# Altium schematic sheet 05 - SAMA7D65-MPU.SchDoc
size B; CompanyName: Microchip Technology Inc.; Organization: Microchip Technology; Address1: 2355 West Chandler Blvd.; Address2: Chandler, AZ  85224; Address4: USA; DocumentNumber: 5; SheetNumber: 5; SheetTotal: 15; SheetTitle: SAMA7D65 SoC
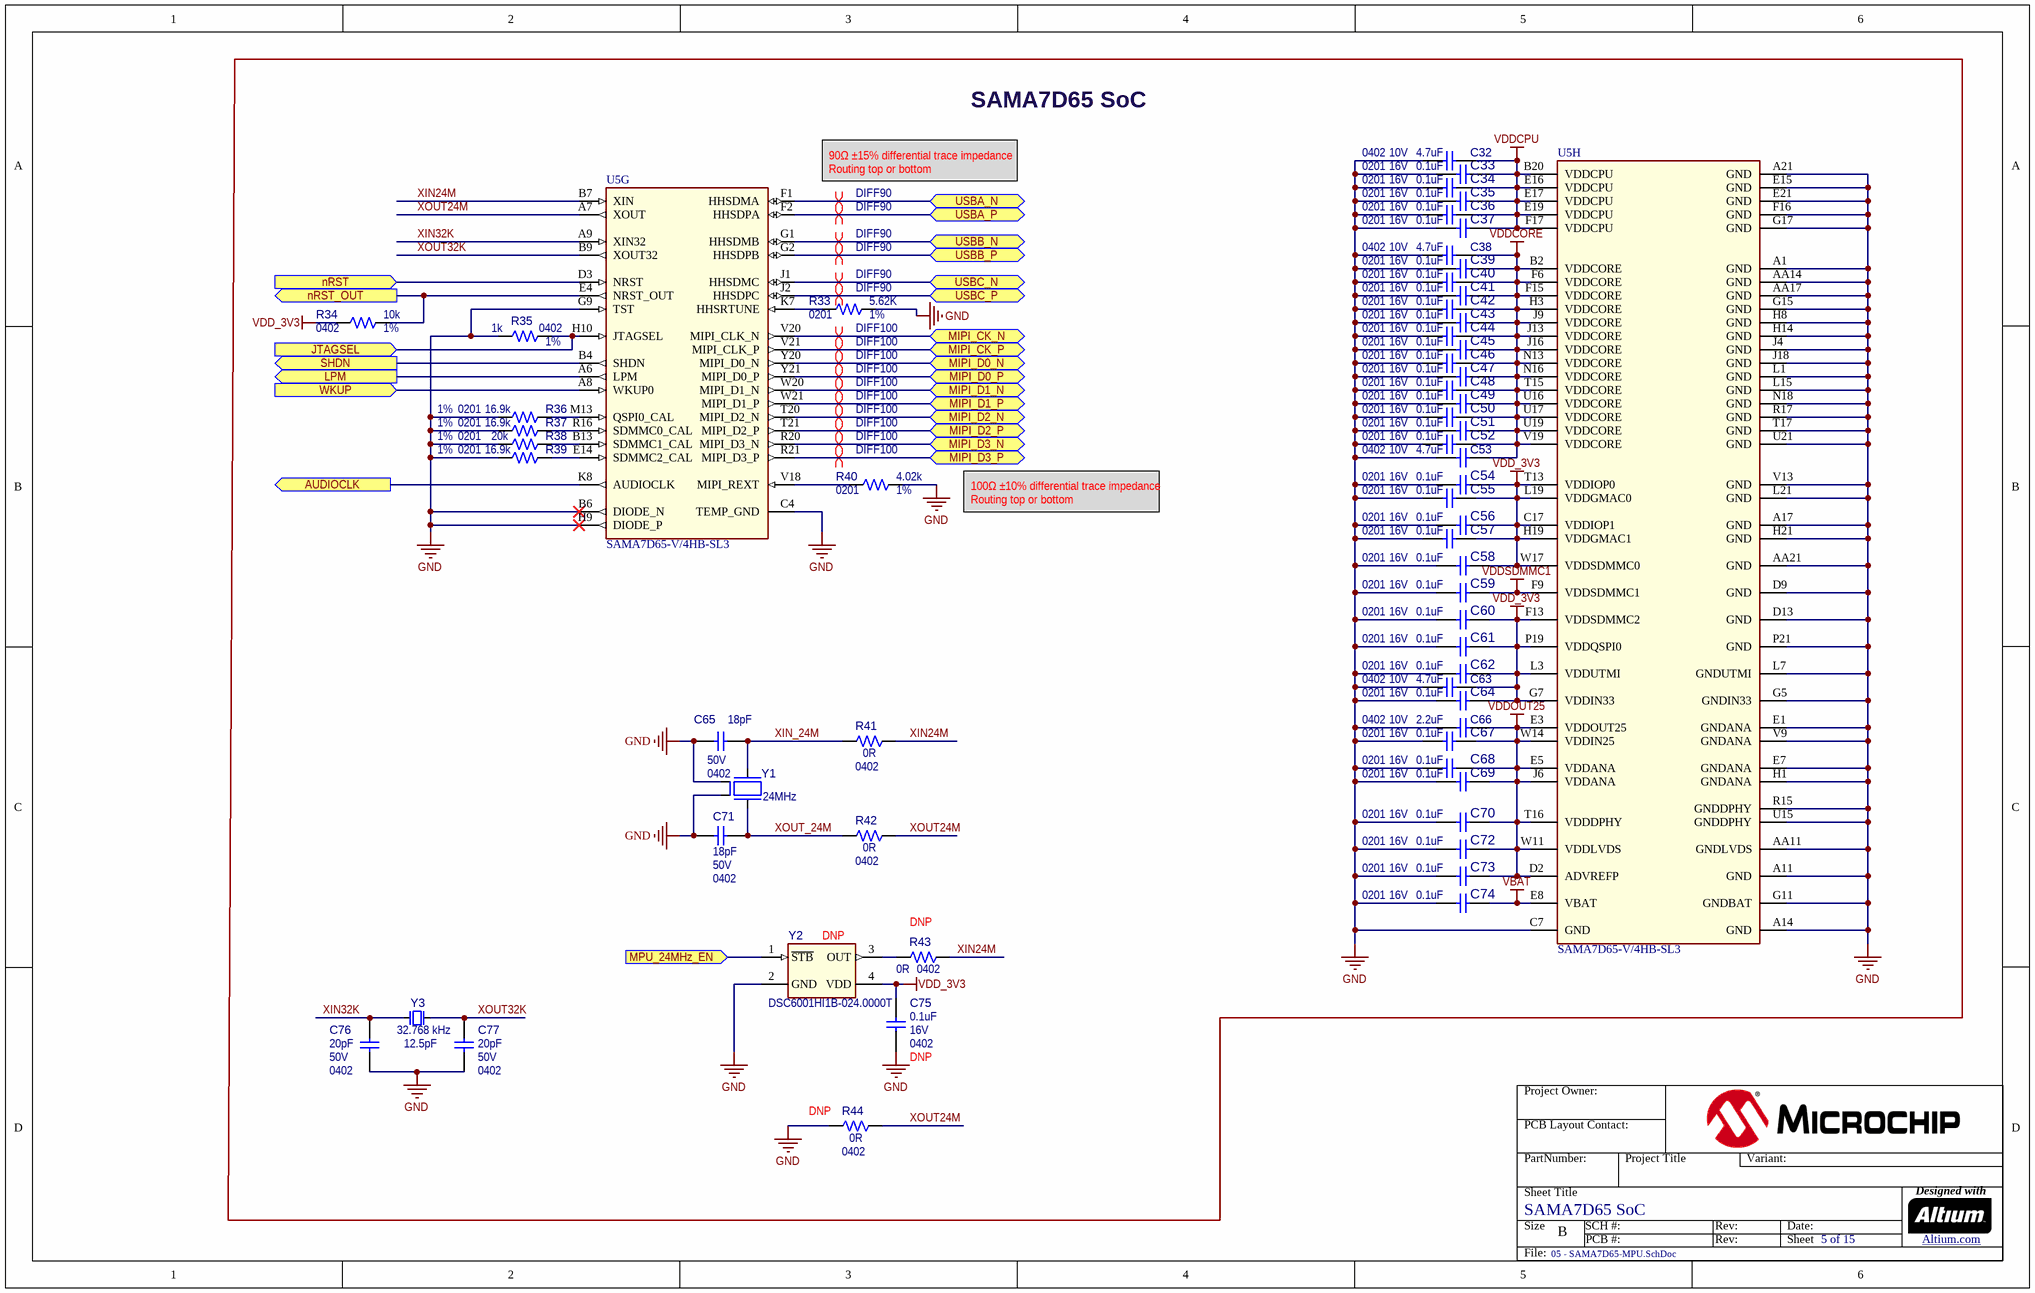
[diagram p0: 05 - SAMA7D65-MPU.SchDoc]

## Parts
C32  value 4.7uF  Voltage: 10V  Package: 0402  [CAP_C_0402]  (hidden comment: Capacitor NP)
C33  value 0.1uF  Voltage: 16V  Package: 0201  [CAP_C_0201]  (hidden comment: Capacitor NP)
C34  value 0.1uF  Voltage: 16V  Package: 0201  [CAP_C_0201]  (hidden comment: Capacitor NP)
C35  value 0.1uF  Voltage: 16V  Package: 0201  [CAP_C_0201]  (hidden comment: Capacitor NP)
C36  value 0.1uF  Voltage: 16V  Package: 0201  [CAP_C_0201]  (hidden comment: Capacitor NP)
C37  value 0.1uF  Voltage: 16V  Package: 0201  [CAP_C_0201]  (hidden comment: Capacitor NP)
C38  value 4.7uF  Voltage: 10V  Package: 0402  [CAP_C_0402]  (hidden comment: Capacitor NP)
C39  value 0.1uF  Voltage: 16V  Package: 0201  [CAP_C_0201]  (hidden comment: Capacitor NP)
C40  value 0.1uF  Voltage: 16V  Package: 0201  [CAP_C_0201]  (hidden comment: Capacitor NP)
C41  value 0.1uF  Voltage: 16V  Package: 0201  [CAP_C_0201]  (hidden comment: Capacitor NP)
C42  value 0.1uF  Voltage: 16V  Package: 0201  [CAP_C_0201]  (hidden comment: Capacitor NP)
C43  value 0.1uF  Voltage: 16V  Package: 0201  [CAP_C_0201]  (hidden comment: Capacitor NP)
C44  value 0.1uF  Voltage: 16V  Package: 0201  [CAP_C_0201]  (hidden comment: Capacitor NP)
C45  value 0.1uF  Voltage: 16V  Package: 0201  [CAP_C_0201]  (hidden comment: Capacitor NP)
C46  value 0.1uF  Voltage: 16V  Package: 0201  [CAP_C_0201]  (hidden comment: Capacitor NP)
C47  value 0.1uF  Voltage: 16V  Package: 0201  [CAP_C_0201]  (hidden comment: Capacitor NP)
C48  value 0.1uF  Voltage: 16V  Package: 0201  [CAP_C_0201]  (hidden comment: Capacitor NP)
C49  value 0.1uF  Voltage: 16V  Package: 0201  [CAP_C_0201]  (hidden comment: Capacitor NP)
C50  value 0.1uF  Voltage: 16V  Package: 0201  [CAP_C_0201]  (hidden comment: Capacitor NP)
C51  value 0.1uF  Voltage: 16V  Package: 0201  [CAP_C_0201]  (hidden comment: Capacitor NP)
C52  value 0.1uF  Voltage: 16V  Package: 0201  [CAP_C_0201]  (hidden comment: Capacitor NP)
C53  value 4.7uF  Voltage: 10V  Package: 0402  [CAP_C_0402]  (hidden comment: Capacitor NP)
C54  value 0.1uF  Voltage: 16V  Package: 0201  [CAP_C_0201]  (hidden comment: Capacitor NP)
C55  value 0.1uF  Voltage: 16V  Package: 0201  [CAP_C_0201]  (hidden comment: Capacitor NP)
C56  value 0.1uF  Voltage: 16V  Package: 0201  [CAP_C_0201]  (hidden comment: Capacitor NP)
C57  value 0.1uF  Voltage: 16V  Package: 0201  [CAP_C_0201]  (hidden comment: Capacitor NP)
C58  value 0.1uF  Voltage: 16V  Package: 0201  [CAP_C_0201]  (hidden comment: Capacitor NP)
C59  value 0.1uF  Voltage: 16V  Package: 0201  [CAP_C_0201]  (hidden comment: Capacitor NP)
C60  value 0.1uF  Voltage: 16V  Package: 0201  [CAP_C_0201]  (hidden comment: Capacitor NP)
C61  value 0.1uF  Voltage: 16V  Package: 0201  [CAP_C_0201]  (hidden comment: Capacitor NP)
C62  value 0.1uF  Voltage: 16V  Package: 0201  [CAP_C_0201]  (hidden comment: Capacitor NP)
C63  value 4.7uF  Voltage: 10V  Package: 0402  [CAP_C_0402]  (hidden comment: Capacitor NP)
C64  value 0.1uF  Voltage: 16V  Package: 0201  [CAP_C_0201]  (hidden comment: Capacitor NP)
C65  value 18pF  Voltage: 50V  Package: 0402  [CAP_C_0402]  (hidden comment: Capacitor NP)
C66  value 2.2uF  Voltage: 10V  Package: 0402  [CAP_C_0402]  (hidden comment: Capacitor NP)
C67  value 0.1uF  Voltage: 16V  Package: 0201  [CAP_C_0201]  (hidden comment: Capacitor NP)
C68  value 0.1uF  Voltage: 16V  Package: 0201  [CAP_C_0201]  (hidden comment: Capacitor NP)
C69  value 0.1uF  Voltage: 16V  Package: 0201  [CAP_C_0201]  (hidden comment: Capacitor NP)
C70  value 0.1uF  Voltage: 16V  Package: 0201  [CAP_C_0201]  (hidden comment: Capacitor NP)
C71  value 18pF  Voltage: 50V  Package: 0402  [CAP_C_0402]  (hidden comment: Capacitor NP)
C72  value 0.1uF  Voltage: 16V  Package: 0201  [CAP_C_0201]  (hidden comment: Capacitor NP)
C73  value 0.1uF  Voltage: 16V  Package: 0201  [CAP_C_0201]  (hidden comment: Capacitor NP)
C74  value 0.1uF  Voltage: 16V  Package: 0201  [CAP_C_0201]  (hidden comment: Capacitor NP)
C75  value 0.1uF  Voltage: 16V  Package: 0402  Populated: DNP  [CAP_C_0402]  (hidden comment: Capacitor NP)
C76  value 20pF  Voltage: 50V  Package: 0402  [CAP_C_0402]  (hidden comment: Capacitor NP)
C77  value 20pF  Voltage: 50V  Package: 0402  [CAP_C_0402]  (hidden comment: Capacitor NP)
R33  value 5.62K  Package: 0201  Tolerance: 1%  [RES_C_0201]  (hidden comment: Resistor)
R34  value 10k  Package: 0402  Tolerance: 1%  [RES_C_0402]  (hidden comment: Resistor)
R35  value 1k  Package: 0402  Tolerance: 1%  [RES_C_0402]  (hidden comment: Resistor)
R36  value 16.9k  Package: 0201  Tolerance: 1%  [RES_C_0201]  (hidden comment: Resistor)
R37  value 16.9k  Package: 0201  Tolerance: 1%  [RES_C_0201]  (hidden comment: Resistor)
R38  value 20k  Package: 0201  Tolerance: 1%  [RES_C_0201]  (hidden comment: Resistor)
R39  value 16.9k  Package: 0201  Tolerance: 1%  [RES_C_0201]  (hidden comment: Resistor)
R40  value 4.02k  Package: 0201  Tolerance: 1%  [RES_C_0201]  (hidden comment: Resistor)
R41  value 0R  Package: 0402  [RES_C_0402]  (hidden comment: Resistor)
R42  value 0R  Package: 0402  [RES_C_0402]  (hidden comment: Resistor)
R43  value 0R  Package: 0402  Populated: DNP  [RES_C_0402]  (hidden comment: Resistor)
R44  value 0R  Package: 0402  Populated: DNP  [RES_C_0402]  (hidden comment: Resistor)
U5  value SAMA7D65-V/4HB-SL3  [TFBGA-343_14x14]  (hidden comment: SAMA7D65)  (parts G,H of 8)
Y1  value 24MHz  [CRYSTAL_L2.0W1.6H0.5_FA-128]  (hidden comment: Crystal 4 Pins)
Y2  Manufacturer Part Number 1: DSC6001HI1B-024.0000T  Populated: DNP  [DFN-4_VFLGA_1.6 X 1.2]  (hidden comment: DSC60xx DFN-4_LGA-4)
Y3  value 32.768 kHz  Load Capacitance: 12.5pF  [CRYSTAL_FC-12M_L2.05W1.2H0.6]  (hidden comment: Crystal 2 Pins)

## Blocks framed on the sheet
SAMA7D65 SoC: C32-C77 R33-R44 U5 Y1-Y3

## Ports
AUDIOCLK (out), JTAGSEL (in), LPM (out), MIPI_CK_N (bidir), MIPI_CK_P (bidir), MIPI_D0_N (bidir), MIPI_D0_P (bidir), MIPI_D1_N (bidir), MIPI_D1_P (bidir), MIPI_D2_N (bidir), MIPI_D2_P (bidir), MIPI_D3_N (bidir), MIPI_D3_P (bidir), MPU_24MHz_EN (in), nRST (in), nRST_OUT (out), SHDN (out), USBA_N (bidir), USBA_P (bidir), USBB_N (bidir), USBB_P (bidir), USBC_N (bidir), USBC_P (bidir), WKUP (in)

## Nets
GND: C32.2 C33.2 C34.2 C35.2 C36.2 C37.2 C38.2 C39.2 C40.2 C41.2 C42.2 C43.2 C44.2 C45.2 C46.2 C47.2 C48.2 C49.2 C50.2 C51.2 C52.2 C53.2 C54.2 C55.2 C56.2 C57.2 C58.2 C59.2 C60.2 C61.2 C62.2 C63.1 C64.2 C65.2 C66.1 C67.2 C68.2 C69.2 C70.2 C71.2 C72.2 C73.2 C74.2 C75.1 C76.2 C77.2 R33.2 R35.2 R36.1 R37.1 R38.1 R39.1 R40.2 R44.1 U5.A1(GND) U5.A11(GND) U5.A14(GND) U5.A17(GND) U5.A21(GND) U5.AA11(GNDLVDS) U5.AA14(GND) U5.AA17(GND) U5.AA21(GND) U5.B6(DIODE_N) U5.C4(TEMP_GND) U5.C7(GND) U5.D9(GND) U5.D13(GND) U5.E1(GNDANA) U5.E7(GNDANA) U5.E15(GND) U5.E21(GND) U5.F16(GND) U5.G5(GNDIN33) U5.G9(TST) U5.G11(GNDBAT) U5.G15(GND) U5.G17(GND) U5.H1(GNDANA) U5.H8(GND) U5.H9(DIODE_P) U5.H14(GND) U5.H21(GND) U5.J4(GND) U5.J18(GND) U5.L1(GND) U5.L7(GNDUTMI) U5.L15(GND) U5.L21(GND) U5.N18(GND) U5.P21(GND) U5.R15(GNDDPHY) U5.R17(GND) U5.T17(GND) U5.U15(GNDDPHY) U5.U21(GND) U5.V9(GNDANA) U5.V13(GND) Y1.2(GND) Y1.4(GND) Y2.2(GND)
VBAT: C74.1 U5.E8(VBAT)
VDD_3V3: C54.1 C55.1 C56.1 C57.1 C58.1 C60.1 C61.1 C62.1 C63.2 C64.1 C75.2 R34.1 U5.C17(VDDIOP1) U5.F13(VDDSDMMC2) U5.G7(VDDIN33) U5.H19(VDDGMAC1) U5.L3(VDDUTMI) U5.L19(VDDGMAC0) U5.P19(VDDQSPI0) U5.T13(VDDIOP0) U5.W17(VDDSDMMC0) Y2.4(VDD)
VDDCORE: C38.1 C39.1 C40.1 C41.1 C42.1 C43.1 C44.1 C45.1 C46.1 C47.1 C48.1 C49.1 C50.1 C51.1 C52.1 C53.1 U5.B2(VDDCORE) U5.F6(VDDCORE) U5.F15(VDDCORE) U5.H3(VDDCORE) U5.J9(VDDCORE) U5.J13(VDDCORE) U5.J16(VDDCORE) U5.N13(VDDCORE) U5.N16(VDDCORE) U5.T15(VDDCORE) U5.U16(VDDCORE) U5.U17(VDDCORE) U5.U19(VDDCORE) U5.V19(VDDCORE)
VDDCPU: C32.1 C33.1 C34.1 C35.1 C36.1 C37.1 U5.B20(VDDCPU) U5.E16(VDDCPU) U5.E17(VDDCPU) U5.E19(VDDCPU) U5.F17(VDDCPU)
VDDOUT25: C66.2 C67.1 C68.1 C69.1 C70.1 C72.1 C73.1 U5.D2(ADVREFP) U5.E3(VDDOUT25) U5.E5(VDDANA) U5.J6(VDDANA) U5.T16(VDDDPHY) U5.W11(VDDLVDS) U5.W14(VDDIN25)
VDDSDMMC1: C59.1 U5.F9(VDDSDMMC1)
AUDIOCLK: U5.K8(AUDIOCLK) ; port AUDIOCLK
JTAGSEL: R35.1 U5.H10(JTAGSEL) ; port JTAGSEL
LPM: U5.A6(LPM) ; port LPM
MIPI_CK_N: U5.V20(MIPI_CLK_N) ; port MIPI_CK_N
MIPI_CK_P: U5.V21(MIPI_CLK_P) ; port MIPI_CK_P
MIPI_D0_N: U5.Y20(MIPI_D0_N) ; port MIPI_D0_N
MIPI_D0_P: U5.Y21(MIPI_D0_P) ; port MIPI_D0_P
MIPI_D1_N: U5.W20(MIPI_D1_N) ; port MIPI_D1_N
MIPI_D1_P: U5.W21(MIPI_D1_P) ; port MIPI_D1_P
MIPI_D2_N: U5.T20(MIPI_D2_N) ; port MIPI_D2_N
MIPI_D2_P: U5.T21(MIPI_D2_P) ; port MIPI_D2_P
MIPI_D3_N: U5.R20(MIPI_D3_N) ; port MIPI_D3_N
MIPI_D3_P: U5.R21(MIPI_D3_P) ; port MIPI_D3_P
MPU_24MHz_EN: Y2.1(~{STB}) ; port MPU_24MHz_EN
nRST: U5.D3(NRST) ; port nRST
nRST_OUT: R34.2 U5.E4(NRST_OUT) ; port nRST_OUT
SHDN: U5.B4(SHDN) ; port SHDN
USBA_N: U5.F1(HHSDMA) ; port USBA_N
USBA_P: U5.F2(HHSDPA) ; port USBA_P
USBB_N: U5.G1(HHSDMB) ; port USBB_N
USBB_P: U5.G2(HHSDPB) ; port USBB_P
USBC_N: U5.J1(HHSDMC) ; port USBC_N
USBC_P: U5.J2(HHSDPC) ; port USBC_P
WKUP: U5.A8(WKUP0) ; port WKUP
XIN24M: R41.2 R43.2 U5.B7(XIN)
XIN32K: C76.1 U5.A9(XIN32) Y3.1(Osc1)
XIN_24M: C65.1 R41.1 Y1.1(Osc1)
XOUT24M: R42.2 R44.2 U5.A7(XOUT)
XOUT32K: C77.1 U5.B9(XOUT32) Y3.2(Osc2)
XOUT_24M: C71.1 R42.1 Y1.3(Osc2)
NetR33_1: R33.1 U5.K7(HHSRTUNE)
NetR36_2: R36.2 U5.M13(QSPI0_CAL)
NetR37_2: R37.2 U5.R16(SDMMC0_CAL)
NetR38_2: R38.2 U5.B13(SDMMC1_CAL)
NetR39_2: R39.2 U5.E14(SDMMC2_CAL)
NetR40_1: R40.1 U5.V18(MIPI_REXT)
NetR43_1: R43.1 Y2.3(OUT)

## Layout directives
differential pair; differential pair class DIFF100; net class DIFF100; rule Matched Net Lengths [Tolerance = 4mil]: MIPI_CK_N, MIPI_CK_P, MIPI_D0_N, MIPI_D0_P, MIPI_D1_N, MIPI_D1_P, MIPI_D2_N, MIPI_D2_P, MIPI_D3_N, MIPI_D3_P
differential pair; differential pair class DIFF90; net class DIFF90; rule Matched Net Lengths [Tolerance = 4mil]: USBA_N, USBA_P, USBB_N, USBB_P, USBC_N, USBC_P

## Notes on the sheet
- 90Ω ±15% differential trace impedance
  Routing top or bottom
- 100Ω ±10% differential trace impedance
  Routing top or bottom
- Project Owner:
- PCB Layout Contact:
- PartNumber:
- Project Title
- Variant:
- Sheet Title
- Size
- B
- SCH #:
- PCB #:
- Rev:
- Date:
- Sheet
- Designed with
- Altium.com <http://go.altium.com/MicrochipLandingPage_Evaluation.html>
- File:

## Library data of the parts
C32 C38 C53 = CAP1684: Manufacturer 1: TDK Corporation; Manufacturer Part Number 1: C1005X5R1A475K050BC; Description_: CAP CER 4.7uF 10V 10% X5R SMD 0402; Dev Tools Status: Production; Tolerance: 10%; Type: Ceramic; Owner: Jesus Aviles; Populated: YES; Temperature Coefficient: X5R; Restricted Sourcing: No; MCHP-ID: CAP1684; Revision: 2; Symbol: Capacitor NP; Status: MCL Design; ComponentLink1Description: SVN Datasheet; ComponentLink2Description: Local Datasheet; ComponentLink3URL: C:\ALTIUM_WORK\00001_MCHP-CDB\Library\LibraryRefs\Capacitor NP.SchLib; ComponentLink3Description: Open Symbol; ComponentLink4URL: C:\ALTIUM_WORK\00001_MCHP-CDB\Library\Footprints\CAP_C_0402.PcbLib; ComponentLink4Description: Open Footprint; ComponentLink5Description: Open Footprint 2; ComponentLink6Description: Open Footprint 3; ComponentLink7Description: Open Footprint 4; Operating Temperature: -55C to 85C; Category: Capacitor; Supplier 1: Digi-Key; Supplier Part Number 1: 445-13820-1-ND; Quantity Override: 1; Manufacturer 2: Samsung Electro-Mechanics; Manufacturer Part Number 2: CL05A475KP5NRNC; Supplier 2: Samsung Electro-Mechanics; Supplier Part Number 2: CL05A475KP5NRNC
C33-C37 C39-C52 C54-C62 C64 C67-C70 C72-C74 = CAP1978: Manufacturer 1: D3_Murata Electronics; Manufacturer Part Number 1: GRM033C71C104KE14J; Description_: CAP CER 0.1uF 16V 10% X7S 0201; Dev Tools Status: Production; Tolerance: 10%; Owner: Dragos Danaila; Populated: YES; Temperature Coefficient: X7S; Restricted Sourcing: No; MCHP-ID: CAP1978; Revision: 2; Symbol: Capacitor NP; Status: MCL Design; ComponentLink1URL: https://chn-vm-apps.microchip.com/mchprepo/parts/Datasheets/GRM033C71C104KE14-01.pdf; ComponentLink1Description: SVN Datasheet; ComponentLink2URL: C:\ALTIUM_WORK\00001_MCHP-CDB\Datasheets\GRM033C71C104KE14-01.pdf; ComponentLink2Description: Local Datasheet; ComponentLink3URL: C:\ALTIUM_WORK\00001_MCHP-CDB\Library\LibraryRefs\Capacitor NP.SchLib; ComponentLink3Description: Open Symbol; ComponentLink4URL: C:\ALTIUM_WORK\00001_MCHP-CDB\Library\Footprints\CAP_C_0201.PcbLib; ComponentLink4Description: Open Footprint; ComponentLink5Description: Open Footprint 2; ComponentLink6Description: Open Footprint 3; ComponentLink7Description: Open Footprint 4; Operating Temperature: -55C to +125C; Category: Capacitor; Supplier 1: Mouser; Supplier Part Number 1: 81-GRM033C71C104KE4J; Quantity Override: 1; Manufacturer 2: D3_Murata Electronics; Manufacturer Part Number 2: GRM033C71C104KE14E; Manufacturer 3: Murata; Manufacturer Part Number 3: GRM033C71C104KE14D; Supplier 2: Mouser; Supplier Part Number 2: 81-GRM033C71C104KE4E; Supplier 3: Digi-Key; Supplier Part Number 3: 490-10387-1-ND
C63 = CAP1684: Manufacturer 1: TDK Corporation; Manufacturer Part Number 1: C1005X5R1A475K050BC; Description_: CAP CER 4.7uF 10V 10% X5R SMD 0402; Dev Tools Status: Production; Tolerance: 10%; Temperature Coefficient: X5R; Type: Ceramic; Owner: Jesus Aviles; Populated: YES; Restricted Sourcing: No; MCHP-ID: CAP1684; Revision: 2; Symbol: Capacitor NP; Status: MCL Design; ComponentLink1Description: SVN Datasheet; ComponentLink2Description: Local Datasheet; ComponentLink3URL: C:\ALTIUM_WORK\00001_MCHP-CDB\Library\LibraryRefs\Capacitor NP.SchLib; ComponentLink3Description: Open Symbol; ComponentLink4URL: C:\ALTIUM_WORK\00001_MCHP-CDB\Library\Footprints\CAP_C_0402.PcbLib; ComponentLink4Description: Open Footprint; ComponentLink5Description: Open Footprint 2; ComponentLink6Description: Open Footprint 3; ComponentLink7Description: Open Footprint 4; Operating Temperature: -55C to 85C; Category: Capacitor; Supplier 1: Digi-Key; Supplier Part Number 1: 445-13820-1-ND; Quantity Override: 1; Manufacturer 2: Samsung Electro-Mechanics; Manufacturer Part Number 2: CL05A475KP5NRNC; Supplier 2: Samsung Electro-Mechanics; Supplier Part Number 2: CL05A475KP5NRNC
C65 C71 = CAP1091: Manufacturer 1: Murata; Manufacturer Part Number 1: GCM1555C1H180JA16D; Description_: CAP CER 18pF 50V 5% C0G SMD 0402; Dev Tools Status: Production; Tolerance: 5%; Temperature Coefficient: C0G; Type: Ceramic; Populated: YES; Owner: Tad Ahlvers; Restricted Sourcing: No; MCHP-ID: CAP1091; Revision: 5; Symbol: Capacitor NP; Status: MCL Design; ComponentLink1URL: https://chn-vm-apps.microchip.com/mchprepo/parts/Datasheets/c02e.pdf; ComponentLink1Description: SVN Datasheet; ComponentLink2URL: C:\ALTIUM_WORK\00001_MCHP-CDB\Datasheets\c02e.pdf; ComponentLink2Description: Local Datasheet; ComponentLink3URL: C:\ALTIUM_WORK\00001_MCHP-CDB\Library\LibraryRefs\Capacitor NP.SchLib; ComponentLink3Description: Open Symbol; ComponentLink4URL: C:\ALTIUM_WORK\00001_MCHP-CDB\Library\Footprints\CAP_C_0402.PcbLib; ComponentLink4Description: Open Footprint; ComponentLink5Description: Open Footprint 2; ComponentLink6Description: Open Footprint 3; ComponentLink7Description: Open Footprint 4; Operating Temperature: -55C to +125C; Category: Capacitor; Supplier 1: Digi-Key; Supplier Part Number 1: 490-12650-2-ND; Quantity Override: 1; Manufacturer 2: Murata; Manufacturer Part Number 2: GRM1555C1H180JA01D; Manufacturer 3: Samsung Electro-Mechanics; Manufacturer Part Number 3: CL05C180JB5NNNC; Manufacturer 4: Yageo; Manufacturer Part Number 4: CC0402JRNPO9BN180; Manufacturer 5: Murata; Manufacturer Part Number 5: GRM1555C1H180JZ01; Supplier 2: Digi-Key; Supplier Part Number 2: 490-5858-1-ND; Supplier 3: Samsung Electro-Mechanics; Supplier Part Number 3: CL05C180JB5NNNC; Supplier 4: Yageo; Supplier Part Number 4: CC0402JRNPO9BN180; Supplier 5: Murata; Supplier Part Number 5: GRM1555C1H180JZ01
C66 = CAP2870: Manufacturer 1: Murata Electronics; Manufacturer Part Number 1: GRM155Z71A225KE44D; Description_: CAP CER 2.2uF 10V 10% X7R SMD 0402; Dev Tools Status: Design; Tolerance: 10%; Temperature Coefficient: X7R; Type: Ceramic; Owner: Pilar Alcaine; Populated: YES; Restricted Sourcing: No; MCHP-ID: CAP2870; Revision: 1; Symbol: Capacitor NP; Status: MCL Design; ComponentLink1URL: https://chn-vm-apps.microchip.com/mchprepo/parts/Datasheets/GRM155Z71A225KE44-01A.pdf; ComponentLink1Description: SVN Datasheet; ComponentLink2URL: C:\ALTIUM_WORK\00001_MCHP-CDB\Datasheets\GRM155Z71A225KE44-01A.pdf; ComponentLink2Description: Local Datasheet; ComponentLink3URL: C:\ALTIUM_WORK\00001_MCHP-CDB\Library\LibraryRefs\Capacitor NP.SchLib; ComponentLink3Description: Open Symbol; ComponentLink4URL: C:\ALTIUM_WORK\00001_MCHP-CDB\Library\Footprints\CAP_C_0402.PcbLib; ComponentLink4Description: Open Footprint; ComponentLink5Description: Open Footprint 2; ComponentLink6Description: Open Footprint 3; ComponentLink7Description: Open Footprint 4; Operating Temperature: -55C to +125C; Category: Capacitor; Supplier 1: Digi-Key; Supplier Part Number 1: 490-GRM155Z71A225KE44DCT-ND; Quantity Override: 1
C75 = CAP1033: Manufacturer 1: Hottech; Manufacturer Part Number 1: C1005B104K160NT; Description_: CAP CER 0.1uF 16V 10% X7R SMD 0402; Dev Tools Status: Production; Tolerance: 10%; Type: Ceramic; Owner: Sompoch Loboonlert; Temperature Coefficient: X7R; Restricted Sourcing: No; MCHP-ID: CAP1033; Revision: 10; Symbol: Capacitor NP; Status: MCL Design; ComponentLink1URL: https://chn-vm-apps.microchip.com/mchprepo/parts/Datasheets/L0005E.pdf; ComponentLink1Description: SVN Datasheet; ComponentLink2URL: C:\ALTIUM_WORK\00001_MCHP-CDB\Datasheets\L0005E.pdf; ComponentLink2Description: Local Datasheet; ComponentLink3URL: C:\ALTIUM_WORK\00001_MCHP-CDB\Library\LibraryRefs\Capacitor NP.SchLib; ComponentLink3Description: Open Symbol; ComponentLink4URL: C:\ALTIUM_WORK\00001_MCHP-CDB\Library\Footprints\CAP_C_0402.PcbLib; ComponentLink4Description: Open Footprint; ComponentLink5Description: Open Footprint 2; ComponentLink6Description: Open Footprint 3; ComponentLink7Description: Open Footprint 4; Operating Temperature: -55C to +125C; Category: Capacitor; Manufacturer 2: KEMET; Manufacturer Part Number 2: C0402C104K4RAC7867; Supplier 1: Hottech; Supplier Part Number 1: C1005B104K160NT; Supplier 2: Digi-Key; Supplier Part Number 2: 399-C0402C104K4RAC7867TR-ND; Quantity Override: 1; Manufacturer 3: Samsung Electro-Mechanics; Manufacturer Part Number 3: CL05B104KO5NNNC; Supplier 3: Digi-Key; Supplier Part Number 3: 1276-1001-1-ND; Manufacturer 4: Würth Elektronik; Manufacturer Part Number 4: 885012205037; Manufacturer 5: Samsung Electro-Mechanics; Manufacturer Part Number 5: CL05B104KO5NNND; Manufacturer 6: Samsung Electro-Mechanics; Manufacturer Part Number 6: CL05B104KO5NNNO; Manufacturer 7: Yageo; Manufacturer Part Number 7: CC0402KRX7R7BB104; Supplier 4: Digi-Key; Supplier Part Number 4: 732-7532-1-ND; Supplier 5: Mouser; Supplier Part Number 5: 187-CL05B104KO5NNND; Supplier 6: Samsung Electro-Mechanics; Supplier Part Number 6: CL05B104KO5NNNO; Supplier 7: Yageo; Supplier Part Number 7: CC0402KRX7R7BB104
C76 C77 = CAP0364: Manufacturer 1: Yageo; Manufacturer Part Number 1: CC0402JRNPO9BN200; Description_: CAP CER 20pF 50V 5% C0G SMD 0402; Dev Tools Status: Production; Tolerance: 5%; Temperature Coefficient: C0G; Type: Ceramic; Populated: YES; Restricted Sourcing: No; MCHP-ID: CAP0364; Revision: 2; Symbol: Capacitor NP; Status: MCL Design; ComponentLink1Description: SVN Datasheet; ComponentLink2Description: Local Datasheet; ComponentLink3URL: C:\ALTIUM_WORK\00001_MCHP-CDB\Library\LibraryRefs\Capacitor NP.SchLib; ComponentLink3Description: Open Symbol; ComponentLink4URL: C:\ALTIUM_WORK\00001_MCHP-CDB\Library\Footprints\CAP_C_0402.PcbLib; ComponentLink4Description: Open Footprint; ComponentLink5Description: Open Footprint 2; ComponentLink6Description: Open Footprint 3; ComponentLink7Description: Open Footprint 4; Operating Temperature: -55C to +125C; Category: Capacitor; Supplier 1: Digi-Key; Supplier Part Number 1: 311-1417-1-ND; Quantity Override: 1; ComponentLink1URL: https://chn-vm-apps.microchip.com/mchprepo/parts/Datasheets/c02e.pdf; ComponentLink2URL: C:\ALTIUM_WORK\00001_MCHP-CDB\Datasheets\c02e.pdf
R33 = RES2053: Manufacturer 1: Yageo; Manufacturer Part Number 1: RC0201FR-075K62L; Description_: RES TKF 5.62K 1% 1/20W SMD 0201; Dev Tools Status: Production; Power: 1/20W; Owner: Ilie Galan; Populated: YES; Temperature Coefficient: 200ppm/C; Restricted Sourcing: No; MCHP-ID: RES2053; Revision: 2; Symbol: Resistor; Status: MCL Design; ComponentLink1URL: https://chn-vm-apps.microchip.com/mchprepo/parts/Datasheets/PYu-RC_Group_51_RoHS_L_12.pdf; ComponentLink1Description: SVN Datasheet; ComponentLink2URL: C:\ALTIUM_WORK\00001_MCHP-CDB\Datasheets\PYu-RC_Group_51_RoHS_L_12.pdf; ComponentLink2Description: Local Datasheet; ComponentLink3URL: C:\ALTIUM_WORK\00001_MCHP-CDB\Library\LibraryRefs\Resistor.SchLib; ComponentLink3Description: Open Symbol; ComponentLink4URL: C:\ALTIUM_WORK\00001_MCHP-CDB\Library\Footprints\RES_C_0201.PcbLib; ComponentLink4Description: Open Footprint; ComponentLink5Description: Open Footprint 2; ComponentLink6Description: Open Footprint 3; ComponentLink7Description: Open Footprint 4; Operating Temperature: -55C to +125C; Category: Resistor; Type: RES SMD; Composition: TKF; Supplier 1: Digi-Key; Supplier Part Number 1: YAG2345CT-ND; Quantity Override: 1
R34 = RSMT1019: Manufacturer 1: Panasonic; Manufacturer Part Number 1: ERJ-2RKF1002X; Description_: RES TKF 10k 1% 1/10W SMD 0402; Dev Tools Status: Production; Voltage: 50V; Power: 1/10W; Populated: YES; Owner: Brent Lanphear; Temperature Coefficient: 100ppm/C; MCHP-ID: RSMT1019; Revision: 2; Symbol: Resistor; Status: MCL Design; ComponentLink1Description: SVN Datasheet; ComponentLink2Description: Local Datasheet; ComponentLink3URL: C:\ALTIUM_WORK\00001_MCHP-CDB\Library\LibraryRefs\Resistor.SchLib; ComponentLink3Description: Open Symbol; ComponentLink4URL: C:\ALTIUM_WORK\00001_MCHP-CDB\Library\Footprints\RES_C_0402.PcbLib; ComponentLink4Description: Open Footprint; ComponentLink5Description: Open Footprint 2; ComponentLink6Description: Open Footprint 3; ComponentLink7Description: Open Footprint 4; Operating Temperature: -55C to +155C; Category: Resistor; Type: RES SMD; Composition: TKF; Supplier 1: Digi-Key; Supplier Part Number 1: P10.0KLCT-ND; Quantity Override: 1; ComponentLink1URL: https://chn-vm-apps.microchip.com/mchprepo/parts/Datasheets/AOA0000CE2.pdf; ComponentLink2URL: C:\ALTIUM_WORK\00001_MCHP-CDB\Datasheets\AOA0000CE2.pdf
R35 = RES1022: Manufacturer 1: Panasonic; Manufacturer Part Number 1: ERJ-2RKF1001X; Description_: RES TKF 1k 1% 1/10W SMD 0402; Dev Tools Status: Production; Voltage: 50V; Power: 1/10W; Owner: Tad Ahlvers; Populated: YES; Temperature Coefficient: 100ppm/C; MCHP-ID: RES1022; Revision: 3; Symbol: Resistor; Status: MCL Design; ComponentLink1URL: https://chn-vm-apps.microchip.com/mchprepo/parts/Datasheets/AOA0000CE2.pdf; ComponentLink1Description: SVN Datasheet; ComponentLink2URL: C:\ALTIUM_WORK\00001_MCHP-CDB\Datasheets\AOA0000CE2.pdf; ComponentLink2Description: Local Datasheet; ComponentLink3URL: C:\ALTIUM_WORK\00001_MCHP-CDB\Library\LibraryRefs\Resistor.SchLib; ComponentLink3Description: Open Symbol; ComponentLink4URL: C:\ALTIUM_WORK\00001_MCHP-CDB\Library\Footprints\RES_C_0402.PcbLib; ComponentLink4Description: Open Footprint; ComponentLink5Description: Open Footprint 2; ComponentLink6Description: Open Footprint 3; ComponentLink7Description: Open Footprint 4; Operating Temperature: -55C to +155C; Category: Resistor; Type: RES SMD; Composition: TKF; Supplier 1: Digi-Key; Supplier Part Number 1: P1.00KLTR-ND; Quantity Override: 1
R36 R37 R39 = RSMT1292: Manufacturer 1: Panasonic Electronic Components; Manufacturer Part Number 1: ERJ-1GNF1692C; Description_: RES TKF 16.9k 1% 1/20W SMD 0201; Dev Tools Status: Production; Power: 1/20W; Owner: Dragos Danaila; Populated: YES; Temperature Coefficient: 200ppm/C; Restricted Sourcing: No; Voltage: 25V; MCHP-ID: RSMT1292; Revision: 2; Symbol: Resistor; Status: MCL Design; ComponentLink1URL: https://chn-vm-apps.microchip.com/mchprepo/parts/Datasheets/AOA0000C304.pdf; ComponentLink1Description: SVN Datasheet; ComponentLink2URL: C:\ALTIUM_WORK\00001_MCHP-CDB\Datasheets\AOA0000C304.pdf; ComponentLink2Description: Local Datasheet; ComponentLink3URL: C:\ALTIUM_WORK\00001_MCHP-CDB\Library\LibraryRefs\Resistor.SchLib; ComponentLink3Description: Open Symbol; ComponentLink4URL: C:\ALTIUM_WORK\00001_MCHP-CDB\Library\Footprints\RES_C_0201.PcbLib; ComponentLink4Description: Open Footprint; ComponentLink5Description: Open Footprint 2; ComponentLink6Description: Open Footprint 3; ComponentLink7Description: Open Footprint 4; Operating Temperature: -55C to +125C; Category: Resistor; Type: RES SMD; Composition: TKF; Supplier 1: Digi-Key; Supplier Part Number 1: P122771TR-ND; Quantity Override: 1
R38 = RES2232: Manufacturer 1: Yageo; Manufacturer Part Number 1: RC0201FR-0720KL; Description_: RES TKF 20k 1% 1/20W SMD 0201; Dev Tools Status: Production; Power: 1/20W; Owner: Ilie Galan; Populated: YES; Temperature Coefficient: 200ppm/C; Restricted Sourcing: No; MCHP-ID: RES2232; Revision: 1; Symbol: Resistor; Status: MCL Design; ComponentLink1URL: https://chn-vm-apps.microchip.com/mchprepo/parts/Datasheets/PYu-RC_Group_51_RoHS_L_10.pdf; ComponentLink1Description: SVN Datasheet; ComponentLink2URL: C:\ALTIUM_WORK\00001_MCHP-CDB\Datasheets\PYu-RC_Group_51_RoHS_L_10.pdf; ComponentLink2Description: Local Datasheet; ComponentLink3URL: C:\ALTIUM_WORK\00001_MCHP-CDB\Library\LibraryRefs\Resistor.SchLib; ComponentLink3Description: Open Symbol; ComponentLink4URL: C:\ALTIUM_WORK\00001_MCHP-CDB\Library\Footprints\RES_C_0201.PcbLib; ComponentLink4Description: Open Footprint; ComponentLink5Description: Open Footprint 2; ComponentLink6Description: Open Footprint 3; ComponentLink7Description: Open Footprint 4; Operating Temperature: -55C to +125C; Category: Resistor; Type: RES SMD; Composition: TKF; Supplier 1: Digi-Key; Supplier Part Number 1: YAG2276CT-ND; Quantity Override: 1
R40 = RES2228: Manufacturer 1: Yageo; Manufacturer Part Number 1: RC0201FR-074K02L; Description_: RES TKF 4.02k 1% 1/20W SMD 0201; Dev Tools Status: Production; Power: 1/20W; Owner: Ilie Galan; Populated: YES; Temperature Coefficient: 200ppm/C; Restricted Sourcing: No; MCHP-ID: RES2228; Revision: 1; Symbol: Resistor; Status: MCL Design; ComponentLink1URL: https://chn-vm-apps.microchip.com/mchprepo/parts/Datasheets/PYu-RC_Group_51_RoHS_L_10.pdf; ComponentLink1Description: SVN Datasheet; ComponentLink2URL: C:\ALTIUM_WORK\00001_MCHP-CDB\Datasheets\PYu-RC_Group_51_RoHS_L_10.pdf; ComponentLink2Description: Local Datasheet; ComponentLink3URL: C:\ALTIUM_WORK\00001_MCHP-CDB\Library\LibraryRefs\Resistor.SchLib; ComponentLink3Description: Open Symbol; ComponentLink4URL: C:\ALTIUM_WORK\00001_MCHP-CDB\Library\Footprints\RES_C_0201.PcbLib; ComponentLink4Description: Open Footprint; ComponentLink5Description: Open Footprint 2; ComponentLink6Description: Open Footprint 3; ComponentLink7Description: Open Footprint 4; Operating Temperature: -55C to +125C; Category: Resistor; Type: RES SMD; Composition: TFK; Supplier 1: Digi-Key; Supplier Part Number 1: YAG2287CT-ND; Quantity Override: 1
R41 R42 = RSMT1040: Manufacturer 1: Yageo; Manufacturer Part Number 1: RC0402JR-070RL; Description_: RES TKF 0R 1/16W SMD 0402; Dev Tools Status: Production; Power: 1/16W; Populated: Yes; Owner: Sompoch Loboonlert; MCHP-ID: RSMT1040; Revision: 3; Symbol: Resistor; Status: MCL Design; ComponentLink1URL: https://chn-vm-apps.microchip.com/mchprepo/parts/Datasheets/PYu-RC0402_51_RoHS_L_6.pdf; ComponentLink1Description: SVN Datasheet; ComponentLink2URL: C:\ALTIUM_WORK\00001_MCHP-CDB\Datasheets\PYu-RC0402_51_RoHS_L_6.pdf; ComponentLink2Description: Local Datasheet; ComponentLink3URL: C:\ALTIUM_WORK\00001_MCHP-CDB\Library\LibraryRefs\Resistor.SchLib; ComponentLink3Description: Open Symbol; ComponentLink4URL: C:\ALTIUM_WORK\00001_MCHP-CDB\Library\Footprints\RES_C_0402.PcbLib; ComponentLink4Description: Open Footprint; ComponentLink5Description: Open Footprint 2; ComponentLink6Description: Open Footprint 3; ComponentLink7Description: Open Footprint 4; Operating Temperature: -55C to +155C; Category: Resistor; Type: RES SMD; Composition: TKF; Supplier 1: Digi-Key; Supplier Part Number 1: 311-0.0JRCT-ND; Quantity Override: 1; Manufacturer 2: Stackpole Electronics Inc; Manufacturer Part Number 2: RMCF0402ZT0R00; Supplier 2: Digi-Key; Supplier Part Number 2: RMCF0402ZT0R00TR-ND
R43 R44 = RSMT1040: Manufacturer 1: Yageo; Manufacturer Part Number 1: RC0402JR-070RL; Description_: RES TKF 0R 1/16W SMD 0402; Dev Tools Status: Production; Power: 1/16W; Owner: Sompoch Loboonlert; MCHP-ID: RSMT1040; Revision: 3; Symbol: Resistor; Status: MCL Design; ComponentLink1URL: https://chn-vm-apps.microchip.com/mchprepo/parts/Datasheets/PYu-RC0402_51_RoHS_L_6.pdf; ComponentLink1Description: SVN Datasheet; ComponentLink2URL: C:\ALTIUM_WORK\00001_MCHP-CDB\Datasheets\PYu-RC0402_51_RoHS_L_6.pdf; ComponentLink2Description: Local Datasheet; ComponentLink3URL: C:\ALTIUM_WORK\00001_MCHP-CDB\Library\LibraryRefs\Resistor.SchLib; ComponentLink3Description: Open Symbol; ComponentLink4URL: C:\ALTIUM_WORK\00001_MCHP-CDB\Library\Footprints\RES_C_0402.PcbLib; ComponentLink4Description: Open Footprint; ComponentLink5Description: Open Footprint 2; ComponentLink6Description: Open Footprint 3; ComponentLink7Description: Open Footprint 4; Operating Temperature: -55C to +155C; Category: Resistor; Type: RES SMD; Composition: TKF; Supplier 1: Digi-Key; Supplier Part Number 1: 311-0.0JRCT-ND; Quantity Override: 1; Manufacturer 2: Stackpole Electronics Inc; Manufacturer Part Number 2: RMCF0402ZT0R00; Supplier 2: Digi-Key; Supplier Part Number 2: RMCF0402ZT0R00TR-ND
U5 = IC2674: SAMA7D65 MPU 1000MHz Cortex-A7 TFBGA-343; Manufacturer 1: Microchip Technology; Description_: MCHP MPU 32-BIT Cortex-A7 1000MHz 128kB SAMA7D65-V/4HB-SL3 TFBGA-343; Populated: YES; MCHP-ID: IC2674; Dev Tools Status: Design; Owner: Ciprian Abramov; Restricted Sourcing: No; Manufacturer Part Number 1: SAMA7D65-V/4HB-SL3; Symbol: SAMA7D65-TFBGA-343; Type: 32-Bit MPU; Status: MCL Design; Revision: 1; Category: MCHP-Microcontroller; ComponentLink1URL: https://www.microchip.com/sitesearch/search/Product%20and%20Development%20Tools/SAMA7D65-V/4HB-SL3; ComponentLink1Description: SVN Datasheet; ComponentLink2Description: Local Datasheet; ComponentLink3URL: C:\ALTIUM_WORK\00001_MCHP-CDB\Library\LibraryRefs\SAMA7D65-TFBGA-343.SchLib; ComponentLink3Description: Open Symbol; ComponentLink4URL: C:\ALTIUM_WORK\00001_MCHP-CDB\Library\Footprints\TFBGA-343_14x14.PcbLib; ComponentLink4Description: Open Footprint; ComponentLink5Description: Open Footprint 2; ComponentLink6Description: Open Footprint 3; ComponentLink7Description: Open Footprint 4; Supplier 1: Microchip Technology; Supplier Part Number 1: SAMA7D65-V/4HB-SL3; Operating Temperature: -40C to +105C; Quantity Override: 1
Y1 = OSC1299: Manufacturer 1: ECS Inc; Manufacturer Part Number 1: ECS-240-10-37B2-JTN-TR; Description_: CRYSTAL 24MHz 10pF SMD L2W1.6H0.5; Dev Tools Status: Design; Owner: Ciprian Abramov; Tolerance: 20ppm; Load Capacitance: 10pF; Populated: YES; MCHP-ID: OSC1299; Revision: 1; Symbol: Crystal 4 Pins; Status: MCL Design; ComponentLink1URL: https://chn-vm-apps.microchip.com/mchprepo/parts/Datasheets/ECX-1637B2.pdf; ComponentLink1Description: SVN Datasheet; ComponentLink2URL: C:\ALTIUM_WORK\00001_MCHP-CDB\Datasheets\ECX-1637B2.pdf; ComponentLink2Description: Local Datasheet; ComponentLink3URL: C:\ALTIUM_WORK\00001_MCHP-CDB\Library\LibraryRefs\Crystal 4 Pins.SchLib; ComponentLink3Description: Open Symbol; ComponentLink4URL: C:\ALTIUM_WORK\00001_MCHP-CDB\Library\Footprints\CRYSTAL_L2.0W1.6H0.5_FA-128.PcbLib; ComponentLink4Description: Open Footprint; ComponentLink5Description: Open Footprint 2; ComponentLink6Description: Open Footprint 3; ComponentLink7Description: Open Footprint 4; Operating Temperature: -40C to +85C; Package: L2.0W1.6H0.5; Type: Crystal; Category: Crystal/Oscillator; Supplier 1: Digi-Key; Supplier Part Number 1: 50-ECS-240-10-37B2-JTN-TR-ND; Quantity Override: 1
Y2 = MIC9495: Manufacturer 1: Microchip Technology; Description_: MCHP CLOCK OSCILLATOR SINGLE 24MHZ DSC6001HI1B-024.0000T SMD DFN-4; Dev Tools Status: Design; Value: 24MHz; Owner: Ciprian Abramov; MCHP-ID: MIC9495; Revision: 1; Symbol: DSC60xx DFN-4_LGA-4; Status: MCL Design; ComponentLink1URL: https://www.microchip.com/sitesearch/search/Product%20and%20Development%20Tools/DSC6001HI1B-024.0000T; ComponentLink1Description: SVN Datasheet; ComponentLink2Description: Local Datasheet; ComponentLink3URL: C:\ALTIUM_WORK\00001_MCHP-CDB\Library\LibraryRefs\DSC60xx DFN-4_LGA-4.SchLib; ComponentLink3Description: Open Symbol; ComponentLink4URL: C:\ALTIUM_WORK\00001_MCHP-CDB\Library\Footprints\DFN-4_VFLGA_1.6 X 1.2.PcbLib; ComponentLink4Description: Open Footprint; ComponentLink5Description: Open Footprint 2; ComponentLink6Description: Open Footprint 3; ComponentLink7Description: Open Footprint 4; Category: MCHP-Clock/Timing; Type: Oscillator; Supplier 1: Microchip Technology; Supplier Part Number 1: DSC6001HI1B-024.0000T; Quantity Override: 1; Operating Temperature: -40C to +85C
Y3 = OSC1269: Crystal; Manufacturer 1: Epson; Manufacturer Part Number 1: FC-12M 32.7680KA-A3; Description_: CRYSTAL 32.768KHZ 12.5PF SMD 2-SMD, No Lead, FC-12M 32.7680KA-A3; Dev Tools Status: Design; Owner: Dragos Danaila; Tolerance: 20ppm; Populated: YES; MCHP-ID: OSC1269; Revision: 1; Symbol: Crystal 2 Pins; Status: MCL Design; ComponentLink1URL: https://chn-vm-apps.microchip.com/mchprepo/parts/Datasheets/FC-12D_en.pdf; ComponentLink1Description: SVN Datasheet; ComponentLink2URL: C:\ALTIUM_WORK\00001_MCHP-CDB\Datasheets\FC-12D_en.pdf; ComponentLink2Description: Local Datasheet; ComponentLink3URL: C:\ALTIUM_WORK\00001_MCHP-CDB\Library\LibraryRefs\Crystal 2 Pins.SchLib; ComponentLink3Description: Open Symbol; ComponentLink4URL: C:\ALTIUM_WORK\00001_MCHP-CDB\Library\Footprints\CRYSTAL_FC-12M_L2.05W1.2H0.6.PcbLib; ComponentLink4Description: Open Footprint; ComponentLink5Description: Open Footprint 2; ComponentLink6Description: Open Footprint 3; ComponentLink7Description: Open Footprint 4; Operating Temperature: -40°C ~ 85°C; Package: 2-SMD, No Lead; Type: Crystal; Category: Crystal/Oscillator; Supplier 1: Digikey; Supplier Part Number 1: SER3672CT-ND; Quantity Override: 1